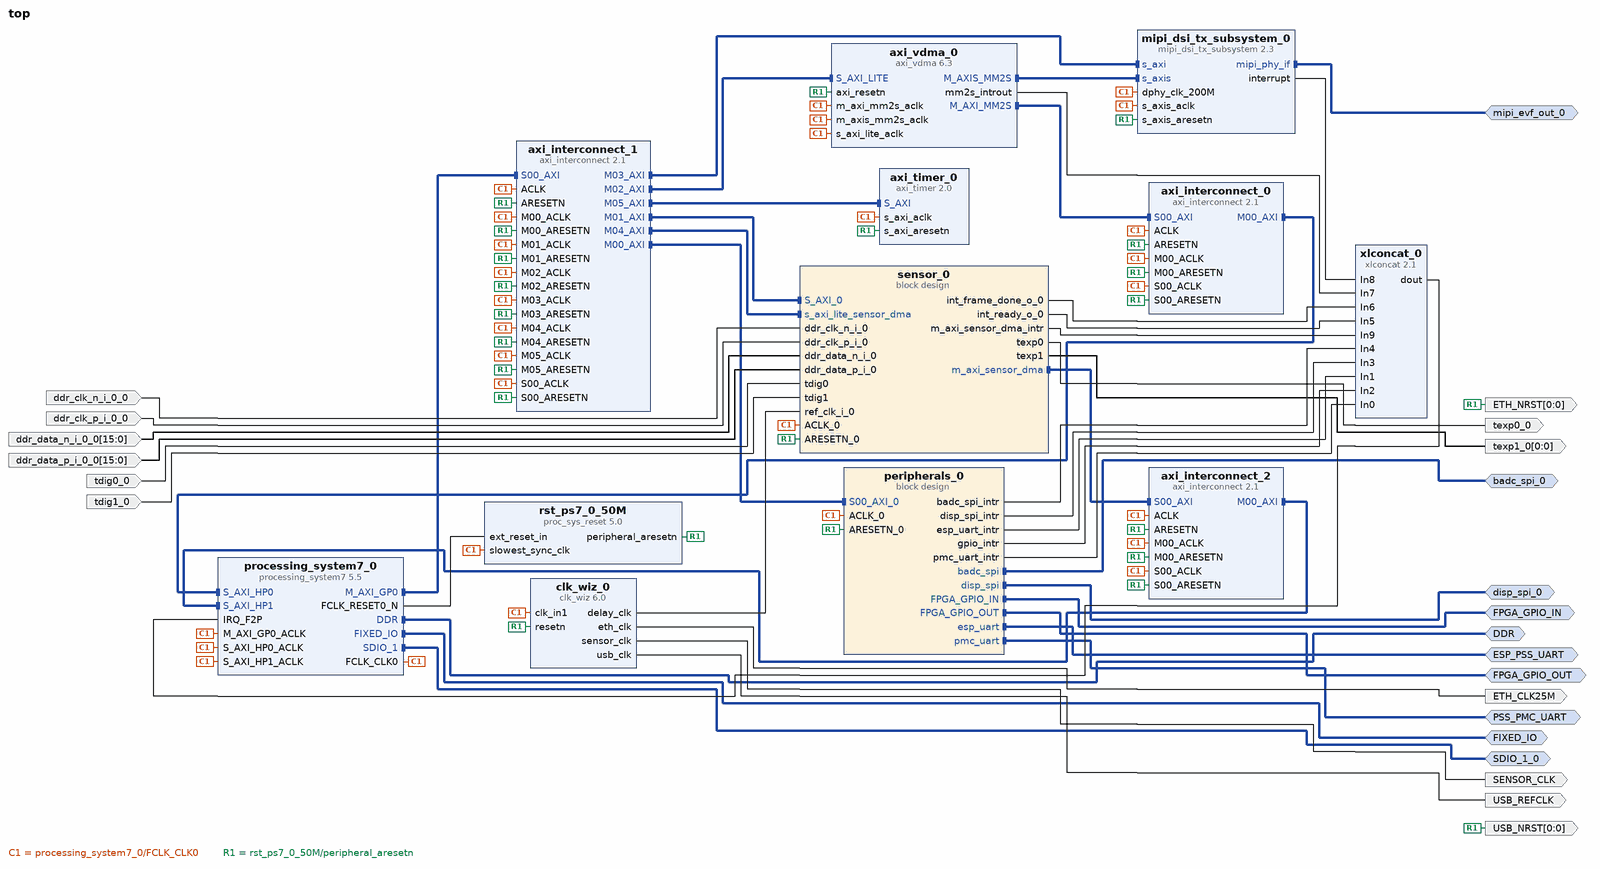
[diagram p0: block diagram of the top level]
# Vivado block design top, xc7z020clg484-2, Vivado 2024.1
create_bd_design top

create_bd_intf_port -mode Master -vlnv xilinx.com:interface:ddrx_rtl:1.0 DDR
create_bd_intf_port -mode Master -vlnv xilinx.com:display_processing_system7:fixedio_rtl:1.0 FIXED_IO
create_bd_intf_port -mode Master -vlnv xilinx.com:interface:gpio_rtl:1.0 FPGA_GPIO_OUT
create_bd_intf_port -mode Master -vlnv xilinx.com:interface:uart_rtl:1.0 PSS_PMC_UART
create_bd_intf_port -mode Master -vlnv xilinx.com:interface:gpio_rtl:1.0 FPGA_GPIO_IN
create_bd_intf_port -mode Master -vlnv xilinx.com:interface:uart_rtl:1.0 ESP_PSS_UART
create_bd_intf_port -mode Master -vlnv xilinx.com:interface:sdio_rtl:1.0 SDIO_1_0
create_bd_intf_port -mode Master -vlnv xilinx.com:interface:mipi_phy_rtl:1.0 mipi_evf_out_0
create_bd_intf_port -mode Master -vlnv xilinx.com:interface:spi_rtl:1.0 disp_spi_0
create_bd_intf_port -mode Master -vlnv xilinx.com:interface:spi_rtl:1.0 badc_spi_0
create_bd_port -dir O -type clk ETH_CLK25M
create_bd_port -dir O -type clk USB_REFCLK
create_bd_port -dir O -from 0 -to 0 USB_NRST
create_bd_port -dir O -from 0 -to 0 ETH_NRST
create_bd_port -dir O -type clk SENSOR_CLK
create_bd_port -dir I ddr_clk_p_i_0_0
create_bd_port -dir I ddr_clk_n_i_0_0
create_bd_port -dir I -from 15 -to 0 ddr_data_p_i_0_0
create_bd_port -dir I -from 15 -to 0 ddr_data_n_i_0_0
create_bd_port -dir O texp0_0
create_bd_port -dir O -from 0 -to 0 texp1_0
create_bd_port -dir I tdig0_0
create_bd_port -dir I tdig1_0

create_bd_cell -type ip -vlnv xilinx.com:ip:processing_system7:5.5 processing_system7_0
set_property -dict [list \
  CONFIG.PCW_APU_PERIPHERAL_FREQMHZ 767 \
  CONFIG.PCW_ENET1_ENET1_IO {MIO 28 .. 39} \
  CONFIG.PCW_ENET1_GRP_MDIO_ENABLE 1 \
  CONFIG.PCW_ENET1_GRP_MDIO_IO {MIO 52 .. 53} \
  CONFIG.PCW_ENET1_PERIPHERAL_ENABLE 1 \
  CONFIG.PCW_FPGA0_PERIPHERAL_FREQMHZ 200 \
  CONFIG.PCW_FPGA1_PERIPHERAL_FREQMHZ 25 \
  CONFIG.PCW_FPGA2_PERIPHERAL_FREQMHZ 12 \
  CONFIG.PCW_I2C0_GRP_INT_ENABLE 0 \
  CONFIG.PCW_I2C0_I2C0_IO {MIO 26 .. 27} \
  CONFIG.PCW_I2C0_PERIPHERAL_ENABLE 1 \
  CONFIG.PCW_I2C_PERIPHERAL_FREQMHZ 127.777779 \
  CONFIG.PCW_IRQ_F2P_INTR 1 \
  CONFIG.PCW_PRESET_BANK1_VOLTAGE {LVCMOS 3.3V} \
  CONFIG.PCW_QSPI_GRP_SINGLE_SS_ENABLE 1 \
  CONFIG.PCW_QSPI_GRP_SINGLE_SS_IO {MIO 1 .. 6} \
  CONFIG.PCW_QSPI_PERIPHERAL_ENABLE 1 \
  CONFIG.PCW_QSPI_QSPI_IO {MIO 1 .. 6} \
  CONFIG.PCW_SD1_GRP_CD_ENABLE 1 \
  CONFIG.PCW_SD1_GRP_CD_IO EMIO \
  CONFIG.PCW_SD1_GRP_WP_ENABLE 1 \
  CONFIG.PCW_SD1_GRP_WP_IO EMIO \
  CONFIG.PCW_SD1_PERIPHERAL_ENABLE 1 \
  CONFIG.PCW_SD1_SD1_IO {MIO 10 .. 15} \
  CONFIG.PCW_SDIO_PERIPHERAL_FREQMHZ 125 \
  CONFIG.PCW_SINGLE_QSPI_DATA_MODE x4 \
  CONFIG.PCW_TTC0_PERIPHERAL_ENABLE 1 \
  CONFIG.PCW_TTC0_TTC0_IO EMIO \
  CONFIG.PCW_UART0_PERIPHERAL_ENABLE 1 \
  CONFIG.PCW_UART0_UART0_IO {MIO 22 .. 23} \
  CONFIG.PCW_UART_PERIPHERAL_FREQMHZ 100 \
  CONFIG.PCW_UIPARAM_DDR_BUS_WIDTH {16 Bit} \
  CONFIG.PCW_UIPARAM_DDR_PARTNO Custom \
  CONFIG.PCW_USB1_PERIPHERAL_ENABLE 1 \
  CONFIG.PCW_USB1_USB1_IO {MIO 40 .. 51} \
  CONFIG.PCW_USE_FABRIC_INTERRUPT 1 \
  CONFIG.PCW_USE_S_AXI_HP0 1 \
  CONFIG.PCW_USE_S_AXI_HP1 1 \
] [get_bd_cells processing_system7_0]
# 201 more settings of processing_system7_0 are not shown: defaults, MIO pin electricals, DDR timing, and values the tool derives
create_bd_cell -type ip -vlnv xilinx.com:ip:proc_sys_reset:5.0 rst_ps7_0_50M
create_bd_cell -type container -reference sensor sensor_0
set_property -dict [list \
  CONFIG.ACTIVE_SIM_BD sensor.bd \
  CONFIG.ACTIVE_SYNTH_BD sensor.bd \
  CONFIG.ENABLE_DFX 0 \
  CONFIG.LIST_SIM_BD sensor.bd \
  CONFIG.LIST_SYNTH_BD sensor.bd \
  CONFIG.LOCK_PROPAGATE 0 \
] [get_bd_cells sensor_0]
create_bd_cell -type ip -vlnv xilinx.com:ip:clk_wiz:6.0 clk_wiz_0
set_property -dict [list \
  CONFIG.CLKIN1_JITTER_PS 100.0 \
  CONFIG.CLKOUT1_JITTER 120.598 \
  CONFIG.CLKOUT1_PHASE_ERROR 105.461 \
  CONFIG.CLKOUT1_REQUESTED_OUT_FREQ 200.000 \
  CONFIG.CLKOUT2_JITTER 159.475 \
  CONFIG.CLKOUT2_PHASE_ERROR 105.461 \
  CONFIG.CLKOUT2_REQUESTED_OUT_FREQ 50 \
  CONFIG.CLKOUT2_USED true \
  CONFIG.CLKOUT3_JITTER 211.763 \
  CONFIG.CLKOUT3_PHASE_ERROR 105.461 \
  CONFIG.CLKOUT3_REQUESTED_OUT_FREQ 12 \
  CONFIG.CLKOUT3_USED true \
  CONFIG.CLKOUT4_JITTER 183.467 \
  CONFIG.CLKOUT4_PHASE_ERROR 105.461 \
  CONFIG.CLKOUT4_REQUESTED_OUT_FREQ 25 \
  CONFIG.CLKOUT4_USED true \
  CONFIG.CLKOUT5_JITTER 92.799 \
  CONFIG.CLKOUT5_PHASE_ERROR 82.655 \
  CONFIG.CLKOUT5_REQUESTED_OUT_FREQ 200 \
  CONFIG.CLKOUT5_USED false \
  CONFIG.CLK_OUT1_PORT delay_clk \
  CONFIG.CLK_OUT2_PORT sensor_clk \
  CONFIG.CLK_OUT3_PORT usb_clk \
  CONFIG.CLK_OUT4_PORT eth_clk \
  CONFIG.CLK_OUT5_PORT mipi_clk \
  CONFIG.MMCM_CLKFBOUT_MULT_F 4.500 \
  CONFIG.MMCM_CLKIN1_PERIOD 5.000 \
  CONFIG.MMCM_CLKIN2_PERIOD 10.0 \
  CONFIG.MMCM_CLKOUT0_DIVIDE_F 4.500 \
  CONFIG.MMCM_CLKOUT1_DIVIDE 18 \
  CONFIG.MMCM_CLKOUT2_DIVIDE 75 \
  CONFIG.MMCM_CLKOUT3_DIVIDE 36 \
  CONFIG.MMCM_CLKOUT4_DIVIDE 1 \
  CONFIG.NUM_OUT_CLKS 4 \
  CONFIG.RESET_PORT resetn \
  CONFIG.RESET_TYPE ACTIVE_LOW \
  CONFIG.USE_LOCKED false \
] [get_bd_cells clk_wiz_0]
create_bd_cell -type ip -vlnv xilinx.com:ip:axi_interconnect:2.1 axi_interconnect_1
set_property -dict {CONFIG.NUM_MI 6} [get_bd_cells axi_interconnect_1]
create_bd_cell -type ip -vlnv xilinx.com:ip:xlconcat:2.1 xlconcat_0
set_property -dict {CONFIG.NUM_PORTS 10} [get_bd_cells xlconcat_0]
create_bd_cell -type container -reference peripherals peripherals_0
set_property -dict [list \
  CONFIG.ACTIVE_SIM_BD peripherals.bd \
  CONFIG.ACTIVE_SYNTH_BD peripherals.bd \
  CONFIG.ENABLE_DFX 0 \
  CONFIG.LIST_SIM_BD peripherals.bd \
  CONFIG.LIST_SYNTH_BD peripherals.bd \
  CONFIG.LOCK_PROPAGATE 0 \
] [get_bd_cells peripherals_0]
create_bd_cell -type ip -vlnv xilinx.com:ip:axi_interconnect:2.1 axi_interconnect_0
set_property -dict {CONFIG.NUM_MI 1} [get_bd_cells axi_interconnect_0]
create_bd_cell -type ip -vlnv xilinx.com:ip:axi_vdma:6.3 axi_vdma_0
set_property -dict [list \
  CONFIG.c_include_s2mm 0 \
  CONFIG.c_m_axi_mm2s_data_width 128 \
  CONFIG.c_m_axis_mm2s_tdata_width 96 \
  CONFIG.c_mm2s_genlock_mode 0 \
  CONFIG.c_mm2s_max_burst_length 256 \
  CONFIG.c_num_fstores 1 \
  CONFIG.c_use_mm2s_fsync 0 \
] [get_bd_cells axi_vdma_0]
create_bd_cell -type ip -vlnv xilinx.com:ip:mipi_dsi_tx_subsystem:2.3 mipi_dsi_tx_subsystem_0
set_property -dict [list \
  CONFIG.AXIS_TDATA_WIDTH 96 \
  CONFIG.C_DPHY_LANES 4 \
  CONFIG.C_EN_7S_LINERATE_CHECK true \
  CONFIG.C_EN_HS_OBUFTDS false \
  CONFIG.C_INCLUDE_DCS_CMD_MODE true \
  CONFIG.DPHY_EN_REG_IF false \
  CONFIG.DPHY_LINERATE 1000 \
  CONFIG.DSI_LANES 4 \
  CONFIG.DSI_PIXELS 4 \
  CONFIG.SupportLevel 1 \
] [get_bd_cells mipi_dsi_tx_subsystem_0]
create_bd_cell -type ip -vlnv xilinx.com:ip:axi_interconnect:2.1 axi_interconnect_2
set_property -dict {CONFIG.NUM_MI 1} [get_bd_cells axi_interconnect_2]
create_bd_cell -type ip -vlnv xilinx.com:ip:axi_timer:2.0 axi_timer_0
set_property -dict {CONFIG.mode_64bit 1} [get_bd_cells axi_timer_0]

# ---- connections ----

connect_bd_intf_net -intf_net S00_AXI_0_1 [get_bd_intf_pins peripherals_0/S00_AXI_0] [get_bd_intf_pins axi_interconnect_1/M00_AXI]
connect_bd_intf_net [get_bd_intf_pins axi_interconnect_1/S00_AXI] [get_bd_intf_pins processing_system7_0/M_AXI_GP0]
connect_bd_intf_net [get_bd_intf_pins axi_interconnect_2/S00_AXI] [get_bd_intf_pins sensor_0/m_axi_sensor_dma]
connect_bd_intf_net [get_bd_intf_pins axi_interconnect_0/M00_AXI] [get_bd_intf_pins processing_system7_0/S_AXI_HP0]
connect_bd_intf_net [get_bd_intf_pins axi_interconnect_1/M01_AXI] [get_bd_intf_pins sensor_0/S_AXI_0]
connect_bd_intf_net [get_bd_intf_pins axi_vdma_0/S_AXI_LITE] [get_bd_intf_pins axi_interconnect_1/M02_AXI]
connect_bd_intf_net [get_bd_intf_pins mipi_dsi_tx_subsystem_0/s_axi] [get_bd_intf_pins axi_interconnect_1/M03_AXI]
connect_bd_intf_net [get_bd_intf_pins axi_interconnect_1/M05_AXI] [get_bd_intf_pins axi_timer_0/S_AXI]
connect_bd_intf_net [get_bd_intf_pins axi_interconnect_2/M00_AXI] [get_bd_intf_pins processing_system7_0/S_AXI_HP1]
connect_bd_intf_net [get_bd_intf_pins axi_vdma_0/M_AXIS_MM2S] [get_bd_intf_pins mipi_dsi_tx_subsystem_0/s_axis]
connect_bd_intf_net [get_bd_intf_pins axi_vdma_0/M_AXI_MM2S] [get_bd_intf_pins axi_interconnect_0/S00_AXI]
connect_bd_intf_net [get_bd_intf_ports mipi_evf_out_0] [get_bd_intf_pins mipi_dsi_tx_subsystem_0/mipi_phy_if]
connect_bd_intf_net [get_bd_intf_ports FPGA_GPIO_IN] [get_bd_intf_pins peripherals_0/FPGA_GPIO_IN]
connect_bd_intf_net [get_bd_intf_ports FPGA_GPIO_OUT] [get_bd_intf_pins peripherals_0/FPGA_GPIO_OUT]
connect_bd_intf_net [get_bd_intf_ports badc_spi_0] [get_bd_intf_pins peripherals_0/badc_spi]
connect_bd_intf_net [get_bd_intf_ports disp_spi_0] [get_bd_intf_pins peripherals_0/disp_spi]
connect_bd_intf_net [get_bd_intf_ports ESP_PSS_UART] [get_bd_intf_pins peripherals_0/esp_uart]
connect_bd_intf_net [get_bd_intf_ports PSS_PMC_UART] [get_bd_intf_pins peripherals_0/pmc_uart]
connect_bd_intf_net [get_bd_intf_ports DDR] [get_bd_intf_pins processing_system7_0/DDR]
connect_bd_intf_net [get_bd_intf_ports FIXED_IO] [get_bd_intf_pins processing_system7_0/FIXED_IO]
connect_bd_intf_net [get_bd_intf_ports SDIO_1_0] [get_bd_intf_pins processing_system7_0/SDIO_1]
connect_bd_intf_net [get_bd_intf_pins sensor_0/s_axi_lite_sensor_dma] [get_bd_intf_pins axi_interconnect_1/M04_AXI]
connect_bd_net [get_bd_pins axi_vdma_0/mm2s_introut] [get_bd_pins xlconcat_0/In7]
connect_bd_net [get_bd_pins clk_wiz_0/sensor_clk] [get_bd_ports SENSOR_CLK]
connect_bd_net -net ddr_clk_n_i_0_0_1 [get_bd_ports ddr_clk_n_i_0_0] [get_bd_pins sensor_0/ddr_clk_n_i_0]
connect_bd_net -net ddr_clk_p_i_0_0_1 [get_bd_ports ddr_clk_p_i_0_0] [get_bd_pins sensor_0/ddr_clk_p_i_0]
connect_bd_net -net ddr_data_n_i_0_0_1 [get_bd_ports ddr_data_n_i_0_0] [get_bd_pins sensor_0/ddr_data_n_i_0]
connect_bd_net -net ddr_data_p_i_0_0_1 [get_bd_ports ddr_data_p_i_0_0] [get_bd_pins sensor_0/ddr_data_p_i_0]
connect_bd_net [get_bd_pins mipi_dsi_tx_subsystem_0/interrupt] [get_bd_pins xlconcat_0/In8]
connect_bd_net -net peripherals_0_ETH_CLK25M [get_bd_pins clk_wiz_0/eth_clk] [get_bd_ports ETH_CLK25M]
connect_bd_net -net peripherals_0_USB_REFCLK [get_bd_pins clk_wiz_0/usb_clk] [get_bd_ports USB_REFCLK]
connect_bd_net [get_bd_pins peripherals_0/badc_spi_intr] [get_bd_pins xlconcat_0/In4]
connect_bd_net [get_bd_pins peripherals_0/disp_spi_intr] [get_bd_pins xlconcat_0/In3]
connect_bd_net [get_bd_pins peripherals_0/esp_uart_intr] [get_bd_pins xlconcat_0/In1]
connect_bd_net [get_bd_pins peripherals_0/gpio_intr] [get_bd_pins xlconcat_0/In2]
connect_bd_net [get_bd_pins peripherals_0/pmc_uart_intr] [get_bd_pins xlconcat_0/In0]
connect_bd_net -net proc_sys_reset_0_peripheral_aresetn [get_bd_pins processing_system7_0/FCLK_RESET0_N] [get_bd_pins rst_ps7_0_50M/ext_reset_in]
connect_bd_net [get_bd_pins processing_system7_0/FCLK_CLK0] \
  [get_bd_pins processing_system7_0/M_AXI_GP0_ACLK] [get_bd_pins sensor_0/ACLK_0] [get_bd_pins axi_interconnect_1/ACLK] \
  [get_bd_pins axi_interconnect_1/S00_ACLK] [get_bd_pins axi_interconnect_1/M00_ACLK] \
  [get_bd_pins axi_interconnect_1/M01_ACLK] [get_bd_pins clk_wiz_0/clk_in1] [get_bd_pins rst_ps7_0_50M/slowest_sync_clk] \
  [get_bd_pins peripherals_0/ACLK_0] [get_bd_pins axi_interconnect_1/M02_ACLK] [get_bd_pins axi_interconnect_0/S00_ACLK] \
  [get_bd_pins axi_interconnect_0/M00_ACLK] [get_bd_pins axi_interconnect_0/ACLK] \
  [get_bd_pins processing_system7_0/S_AXI_HP0_ACLK] [get_bd_pins axi_interconnect_1/M03_ACLK] \
  [get_bd_pins axi_vdma_0/s_axi_lite_aclk] [get_bd_pins axi_vdma_0/m_axi_mm2s_aclk] [get_bd_pins axi_vdma_0/m_axis_mm2s_aclk] \
  [get_bd_pins mipi_dsi_tx_subsystem_0/s_axis_aclk] [get_bd_pins mipi_dsi_tx_subsystem_0/dphy_clk_200M] \
  [get_bd_pins axi_interconnect_2/ACLK] [get_bd_pins processing_system7_0/S_AXI_HP1_ACLK] \
  [get_bd_pins axi_interconnect_2/S00_ACLK] [get_bd_pins axi_interconnect_2/M00_ACLK] \
  [get_bd_pins axi_interconnect_1/M04_ACLK] [get_bd_pins axi_timer_0/s_axi_aclk] [get_bd_pins axi_interconnect_1/M05_ACLK]
connect_bd_net -net ref_clk_i_0_1 [get_bd_pins clk_wiz_0/delay_clk] [get_bd_pins sensor_0/ref_clk_i_0]
connect_bd_net [get_bd_pins rst_ps7_0_50M/peripheral_aresetn] \
  [get_bd_ports USB_NRST] [get_bd_ports ETH_NRST] [get_bd_pins sensor_0/ARESETN_0] [get_bd_pins axi_interconnect_1/ARESETN] \
  [get_bd_pins axi_interconnect_1/S00_ARESETN] [get_bd_pins axi_interconnect_1/M00_ARESETN] \
  [get_bd_pins axi_interconnect_1/M01_ARESETN] [get_bd_pins clk_wiz_0/resetn] [get_bd_pins peripherals_0/ARESETN_0] \
  [get_bd_pins axi_interconnect_1/M02_ARESETN] [get_bd_pins axi_interconnect_0/ARESETN] \
  [get_bd_pins axi_interconnect_0/S00_ARESETN] [get_bd_pins axi_interconnect_0/M00_ARESETN] \
  [get_bd_pins axi_interconnect_1/M03_ARESETN] [get_bd_pins axi_vdma_0/axi_resetn] \
  [get_bd_pins mipi_dsi_tx_subsystem_0/s_axis_aresetn] [get_bd_pins axi_interconnect_2/ARESETN] \
  [get_bd_pins axi_interconnect_2/M00_ARESETN] [get_bd_pins axi_interconnect_2/S00_ARESETN] \
  [get_bd_pins axi_interconnect_1/M04_ARESETN] [get_bd_pins axi_timer_0/s_axi_aresetn] \
  [get_bd_pins axi_interconnect_1/M05_ARESETN]
connect_bd_net [get_bd_pins sensor_0/int_frame_done_o_0] [get_bd_pins xlconcat_0/In6]
connect_bd_net [get_bd_pins sensor_0/int_ready_o_0] [get_bd_pins xlconcat_0/In5]
connect_bd_net [get_bd_pins sensor_0/m_axi_sensor_dma_intr] [get_bd_pins xlconcat_0/In9]
connect_bd_net [get_bd_pins sensor_0/texp0] [get_bd_ports texp0_0]
connect_bd_net [get_bd_pins sensor_0/texp1] [get_bd_ports texp1_0]
connect_bd_net -net tdig0_0_1 [get_bd_ports tdig0_0] [get_bd_pins sensor_0/tdig0]
connect_bd_net -net tdig1_0_1 [get_bd_ports tdig1_0] [get_bd_pins sensor_0/tdig1]
connect_bd_net [get_bd_pins xlconcat_0/dout] [get_bd_pins processing_system7_0/IRQ_F2P]

# ---- address map ----
assign_bd_address -offset 0x00000000 -range 256M -target_address_space [get_bd_addr_spaces axi_vdma_0/Data_MM2S] [get_bd_addr_segs processing_system7_0/S_AXI_HP0/HP0_DDR_LOWOCM]
assign_bd_address -offset 0x40400000 -range 64K -target_address_space [get_bd_addr_spaces processing_system7_0/Data] [get_bd_addr_segs sensor_0/axi_dma_0/S_AXI_LITE/Reg]
assign_bd_address -offset 0x41200000 -range 64K -target_address_space [get_bd_addr_spaces processing_system7_0/Data] [get_bd_addr_segs peripherals_0/axi_gpio_0/S_AXI/Reg]
assign_bd_address -offset 0x41210000 -range 64K -target_address_space [get_bd_addr_spaces processing_system7_0/Data] [get_bd_addr_segs sensor_0/axi_gpio_0/S_AXI/Reg]
assign_bd_address -offset 0x41E00000 -range 64K -target_address_space [get_bd_addr_spaces processing_system7_0/Data] [get_bd_addr_segs peripherals_0/axi_quad_spi_badc/AXI_LITE/Reg]
assign_bd_address -offset 0x41E10000 -range 64K -target_address_space [get_bd_addr_spaces processing_system7_0/Data] [get_bd_addr_segs peripherals_0/axi_quad_spi_disp/AXI_LITE/Reg]
assign_bd_address -offset 0x42800000 -range 64K -target_address_space [get_bd_addr_spaces processing_system7_0/Data] [get_bd_addr_segs axi_timer_0/S_AXI/Reg]
assign_bd_address -offset 0x42C00000 -range 64K -target_address_space [get_bd_addr_spaces processing_system7_0/Data] [get_bd_addr_segs peripherals_0/axi_uartlite_esp/S_AXI/Reg]
assign_bd_address -offset 0x42C10000 -range 64K -target_address_space [get_bd_addr_spaces processing_system7_0/Data] [get_bd_addr_segs peripherals_0/axi_uartlite_pmc/S_AXI/Reg]
assign_bd_address -offset 0x43000000 -range 64K -target_address_space [get_bd_addr_spaces processing_system7_0/Data] [get_bd_addr_segs axi_vdma_0/S_AXI_LITE/Reg]
assign_bd_address -offset 0x43C00000 -range 64K -target_address_space [get_bd_addr_spaces processing_system7_0/Data] [get_bd_addr_segs mipi_dsi_tx_subsystem_0/s_axi/Reg]
assign_bd_address -offset 0x00000000 -range 256M -target_address_space [get_bd_addr_spaces sensor_0/axi_dma_0/Data_S2MM] [get_bd_addr_segs processing_system7_0/S_AXI_HP1/HP1_DDR_LOWOCM]

validate_bd_design
save_bd_design
